# Altium schematic sheet Table_tennis.SchDoc
size A3
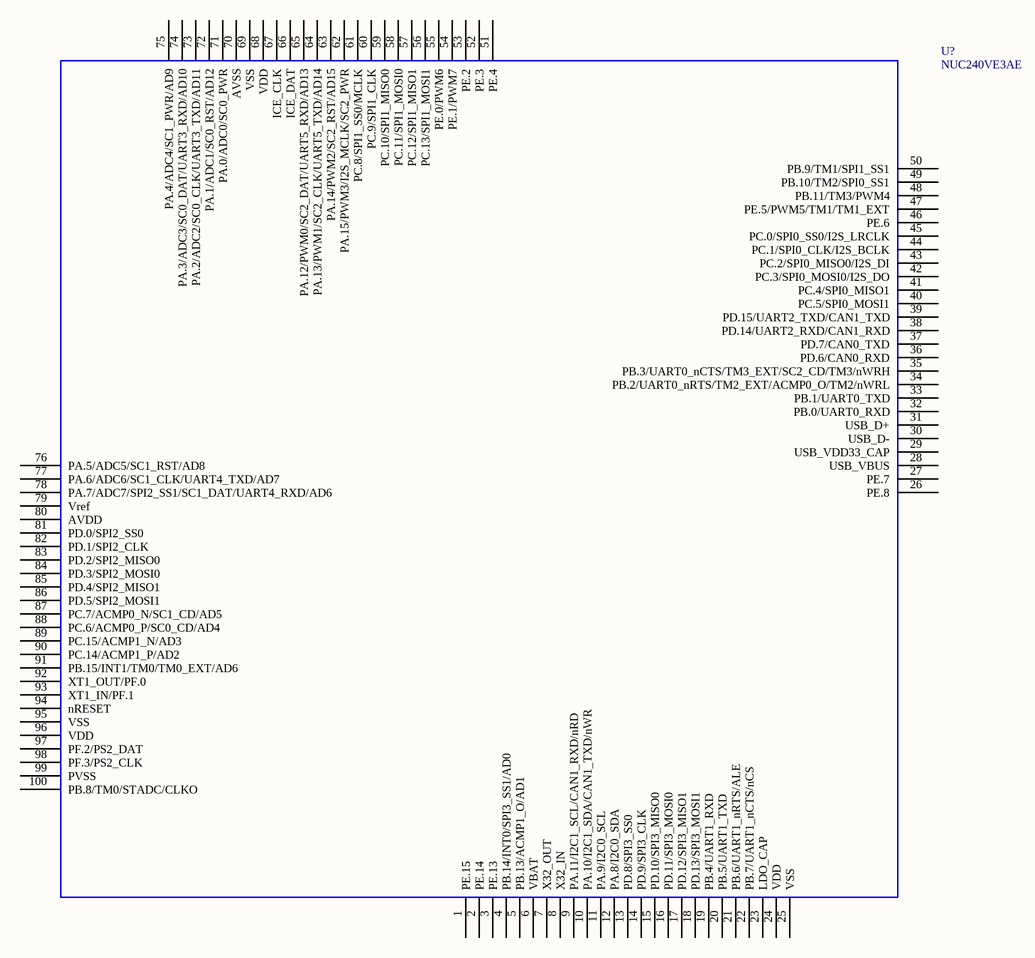
[diagram p0: Table_tennis.SchDoc]

## Parts
U?  NUC240VE3AE  [MCU_LQFP_100]

## Nets

Not connected (* = marked no-connect by the designer): U? 1(PE.15) 2(PE.14) 3(PE.13) 4(PB.14/INT0/SPI3_SS1/AD0) 5(PB.13/ACMP1_O/AD1) 6(VBAT) 7(X32_OUT) 8(X32_IN) 9(PA.11/I2C1_SCL/CAN1_RXD/nRD) 10(PA.10/I2C1_SDA/CAN1_TXD/nWR) 11(PA.9/I2C0_SCL) 12(PA.8/I2C0_SDA) 13(PD.8/SPI3_SS0) 14(PD.9/SPI3_CLK) 15(PD.10/SPI3_MISO0) 16(PD.11/SPI3_MOSI0) 17(PD.12/SPI3_MISO1) 18(PD.13/SPI3_MOSI1) 19(PB.4/UART1_RXD) 20(PB.5/UART1_TXD) 21(PB.6/UART1_nRTS/ALE) 22(PB.7/UART1_nCTS/nCS) 23(LDO_CAP) 24(VDD) 25(VSS) 26(PE.8) 27(PE.7) 28(USB_VBUS) 29(USB_VDD33_CAP) 30(USB_D-) 31(USB_D+) 32(PB.0/UART0_RXD) 33(PB.1/UART0_TXD) 34(PB.2/UART0_nRTS/TM2_EXT/ACMP0_O/TM2/nWRL) 35(PB.3/UART0_nCTS/TM3_EXT/SC2_CD/TM3/nWRH) 36(PD.6/CAN0_RXD) 37(PD.7/CAN0_TXD) 38(PD.14/UART2_RXD/CAN1_RXD) 39(PD.15/UART2_TXD/CAN1_TXD) 40(PC.5/SPI0_MOSI1) 41(PC.4/SPI0_MISO1) 42(PC.3/SPI0_MOSI0/I2S_DO) 43(PC.2/SPI0_MISO0/I2S_DI) 44(PC.1/SPI0_CLK/I2S_BCLK) 45(PC.0/SPI0_SS0/I2S_LRCLK) 46(PE.6) 47(PE.5/PWM5/TM1/TM1_EXT) 48(PB.11/TM3/PWM4) 49(PB.10/TM2/SPI0_SS1) 50(PB.9/TM1/SPI1_SS1) 51(PE.4) 52(PE.3) 53(PE.2) 54(PE.1/PWM7) 55(PE.0/PWM6) 56(PC.13/SPI1_MOSI1) 57(PC.12/SPI1_MISO1) 58(PC.11/SPI1_MOSI0) 59(PC.10/SPI1_MISO0) 60(PC.9/SPI1_CLK) 61(PC.8/SPI1_SS0/MCLK) 62(PA.15/PWM3/I2S_MCLK/SC2_PWR) 63(PA.14/PWM2/SC2_RST/AD15) 64(PA.13/PWM1/SC2_CLK/UART5_TXD/AD14) 65(PA.12/PWM0/SC2_DAT/UART5_RXD/AD13) 66(ICE_DAT) 67(ICE_CLK) 68(VDD) 69(VSS) 70(AVSS) 71(PA.0/ADC0/SC0_PWR) 72(PA.1/ADC1/SC0_RST/AD12) 73(PA.2/ADC2/SC0_CLK/UART3_TXD/AD11) 74(PA.3/ADC3/SC0_DAT/UART3_RXD/AD10) 75(PA.4/ADC4/SC1_PWR/AD9) 76(PA.5/ADC5/SC1_RST/AD8) 77(PA.6/ADC6/SC1_CLK/UART4_TXD/AD7) 78(PA.7/ADC7/SPI2_SS1/SC1_DAT/UART4_RXD/AD6) 79(Vref) 80(AVDD) 81(PD.0/SPI2_SS0) 82(PD.1/SPI2_CLK) 83(PD.2/SPI2_MISO0) 84(PD.3/SPI2_MOSI0) 85(PD.4/SPI2_MISO1) 86(PD.5/SPI2_MOSI1) 87(PC.7/ACMP0_N/SC1_CD/AD5) 88(PC.6/ACMP0_P/SC0_CD/AD4) 89(PC.15/ACMP1_N/AD3) 90(PC.14/ACMP1_P/AD2) 91(PB.15/INT1/TM0/TM0_EXT/AD6) 92(XT1_OUT/PF.0) 93(XT1_IN/PF.1) 94(nRESET) 95(VSS) 96(VDD) 97(PF.2/PS2_DAT) 98(PF.3/PS2_CLK) 99(PVSS) 100(PB.8/TM0/STADC/CLKO)

## Library data of the parts
U? = NUC240VE3AE: OriginalSymbolOrigin: (0,0)